# Altium schematic sheet power-adc.SchDoc
size Letter; CompanyName: Signal Laboratories, Inc.; Address1: 3479 Edison Way; Address2: Menlo Park CA 94025; Address3: +1 (877) 778-8435; Address4: siglabs.com; Revision: 1; SheetNumber: 25; SheetTotal: 53
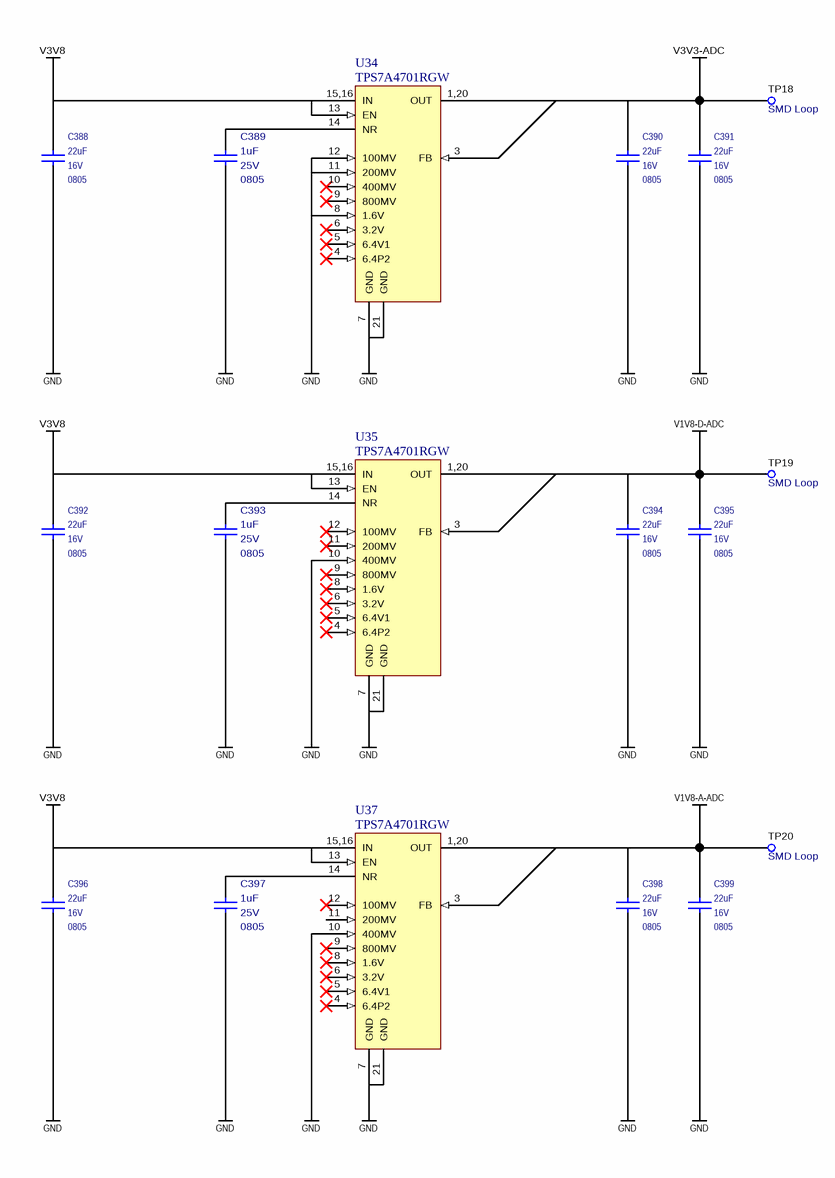
[diagram p0: power-adc.SchDoc]

## Parts
C388  value 22uF  Voltage: 16V  Package: 0805  [CAPC200X125X145L45N]  (hidden comment: CL21A226KOQNNNE)
C389  value 1uF  Package: 0805  Voltage: 25V  [CAPC160X80X90L20N]  (hidden comment: TMK212B7105KG)
C390  value 22uF  Voltage: 16V  Package: 0805  [CAPC200X125X145L45N]  (hidden comment: CL21A226KOQNNNE)
C391  value 22uF  Voltage: 16V  Package: 0805  [CAPC200X125X145L45N]  (hidden comment: CL21A226KOQNNNE)
C392  value 22uF  Voltage: 16V  Package: 0805  [CAPC200X125X145L45N]  (hidden comment: CL21A226KOQNNNE)
C393  value 1uF  Package: 0805  Voltage: 25V  [CAPC160X80X90L20N]  (hidden comment: TMK212B7105KG)
C394  value 22uF  Voltage: 16V  Package: 0805  [CAPC200X125X145L45N]  (hidden comment: CL21A226KOQNNNE)
C395  value 22uF  Voltage: 16V  Package: 0805  [CAPC200X125X145L45N]  (hidden comment: CL21A226KOQNNNE)
C396  value 22uF  Voltage: 16V  Package: 0805  [CAPC200X125X145L45N]  (hidden comment: CL21A226KOQNNNE)
C397  value 1uF  Package: 0805  Voltage: 25V  [CAPC160X80X90L20N]  (hidden comment: TMK212B7105KG)
C398  value 22uF  Voltage: 16V  Package: 0805  [CAPC200X125X145L45N]  (hidden comment: CL21A226KOQNNNE)
C399  value 22uF  Voltage: 16V  Package: 0805  [CAPC200X125X145L45N]  (hidden comment: CL21A226KOQNNNE)
TP18  Notes: SMD Loop  [5015]  (hidden comment: 5015)
TP19  Notes: SMD Loop  [5015]  (hidden comment: 5015)
TP20  Notes: SMD Loop  [5015]  (hidden comment: 5015)
U34  TPS7A4701RGW  [QFN65P500X500X100-21N]
U35  TPS7A4701RGW  [QFN65P500X500X100-21N]
U37  TPS7A4701RGW  [QFN65P500X500X100-21N]

## Nets
GND: C388.1 C389.2 C390.1 C391.1 C392.1 C393.2 C394.1 C395.1 C396.1 C397.2 C398.1 C399.1 U34.7(GND) U34.8(1.6V) U34.11(200MV) U34.12(100MV) U34.21(GND) U35.7(GND) U35.10(400MV) U35.21(GND) U37.7(GND) U37.10(400MV) U37.21(GND)
V1V8-A-ADC: C398.2 C399.2 TP20.1 U37.1(OUT) U37.3(FB) U37.20(OUT)
V1V8-D-ADC: C394.2 C395.2 TP19.1 U35.1(OUT) U35.3(FB) U35.20(OUT)
V3V3-ADC: C390.2 C391.2 TP18.1 U34.1(OUT) U34.3(FB) U34.20(OUT)
V3V8: C388.2 C392.2 C396.2 U34.13(EN) U34.15(IN) U34.16(IN) U35.13(EN) U35.15(IN) U35.16(IN) U37.13(EN) U37.15(IN) U37.16(IN)
NetC389_1: C389.1 U34.14(NR)
NetC393_1: C393.1 U35.14(NR)
NetC397_1: C397.1 U37.14(NR)

Not connected (* = marked no-connect by the designer): U34 4(6.4P2)* 5(6.4V1)* 6(3.2V)* 9(800MV)* 10(400MV)*; U35 4(6.4P2)* 5(6.4V1)* 6(3.2V)* 8(1.6V)* 9(800MV)* 11(200MV)* 12(100MV)*; U37 4(6.4P2)* 5(6.4V1)* 6(3.2V)* 8(1.6V)* 9(800MV)* 11(200MV) 12(100MV)*

## Notes on the sheet
- Title
- Engineer
- Revision
- Drawn By
- Checked By
- Date
- Sheet
- of
- (in symbol TPS7A4701RGW_1) 15,16; 1,20

## Library data of the parts
C388 C390-C392 C394-C396 C398 C399 = CAP 0603: Ceramic Capacitor 22uF ±20% 16V X5R 0805; Manufacturer: Samsung Electro-Mechanics; Tr: -55:85; Manufacturer P/N: CL21A226KOQNNNE; Tolerance: ±20%
C389 C393 C397 = TMK212B7105KG: Ceramic Capacitor 1uF ±10% 25V X7R 0805; Manufacturer: Taiyo Yuden; pF: 1000000; Manufacturer P/N: TMK212B7105KG; Tolerance: ±10%; Tr: *
TP18-TP20 = TEST_POINT_SMD_50: Test Point SMD; Manufacturer: Keystone; Manufacturer P/N: 5015
U34 U35 U37 = TPS7A4701RGW_1: Low-Dropout Linear Regulator 20-VQFN; Manufacturer: Texas Instruments; Manufacturer P/N: TPS7A4701RGW; Package: VQFN-20